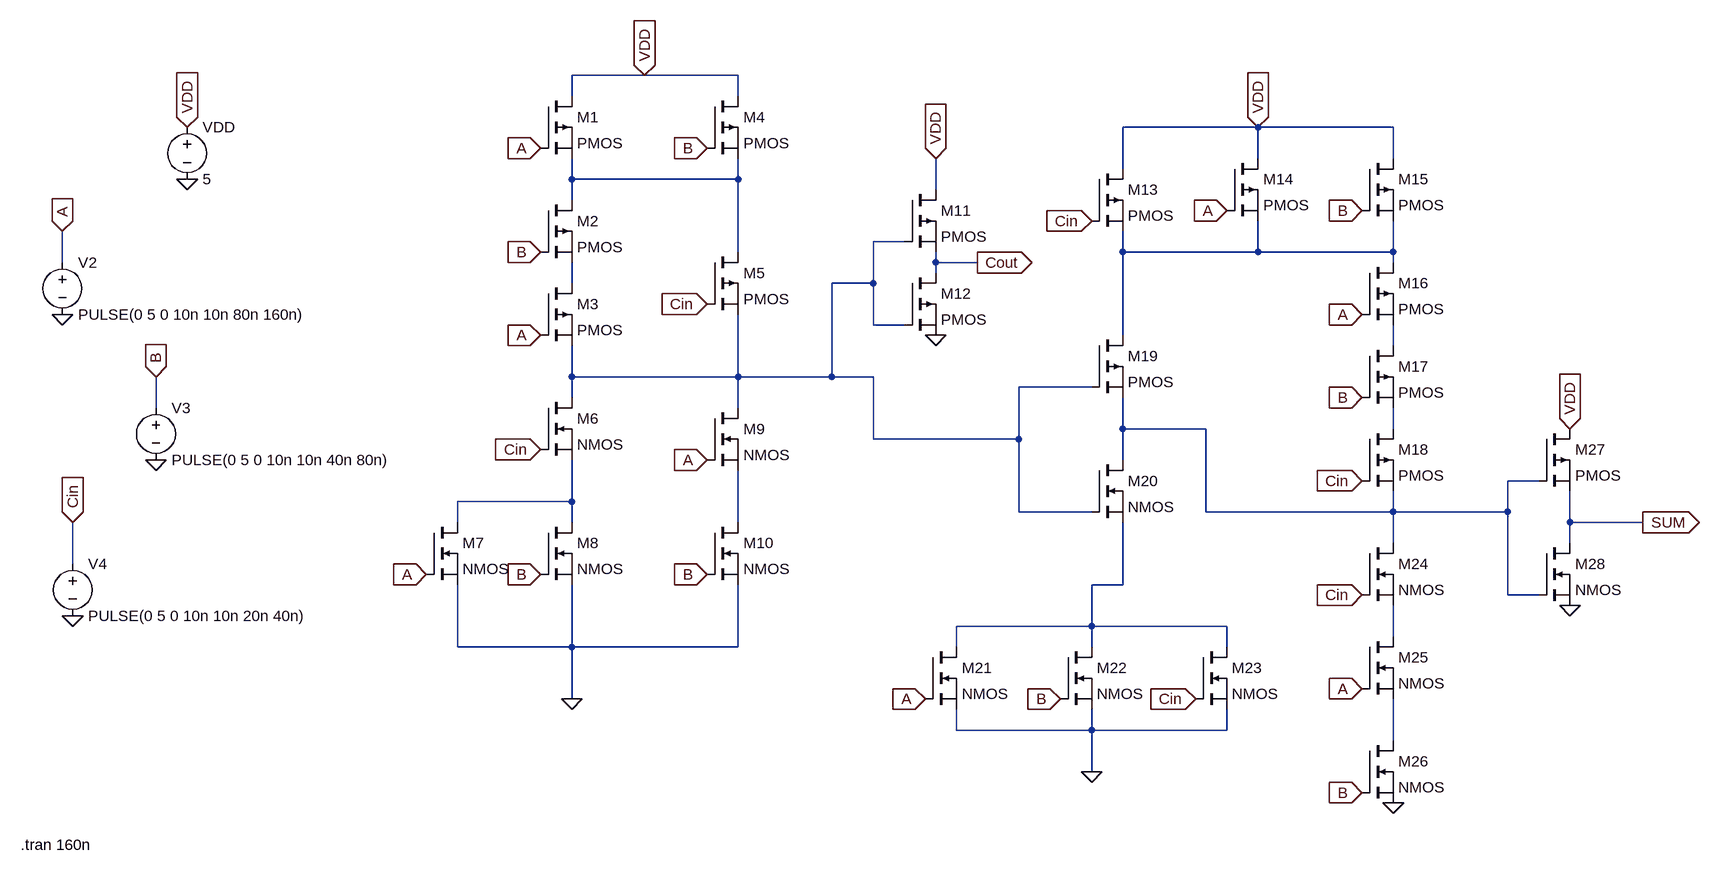
[diagram p0: schematic Draft1.asc]
Draft1.asc, the LTspice schematic file:
Version 4.1
SHEET 1 1920 1168
WIRE 272 -32 160 -32
WIRE 416 -32 272 -32
WIRE 160 0 160 -32
WIRE 416 0 416 -32
WIRE 1216 48 1008 48
WIRE 1424 48 1216 48
WIRE 1216 96 1216 48
WIRE 1424 96 1424 48
WIRE 1008 112 1008 48
WIRE 160 128 160 96
WIRE 416 128 416 96
WIRE 416 128 160 128
WIRE 720 144 720 96
WIRE 160 160 160 128
WIRE 672 224 624 224
WIRE 416 240 416 128
WIRE 1008 240 1008 208
WIRE 1216 240 1216 192
WIRE 1216 240 1008 240
WIRE 1424 240 1424 192
WIRE 1424 240 1216 240
WIRE -624 256 -624 208
WIRE 720 256 720 240
WIRE 784 256 720 256
WIRE 1424 256 1424 240
WIRE 720 272 720 256
WIRE 160 288 160 256
WIRE 624 288 624 224
WIRE 624 288 560 288
WIRE 624 352 624 288
WIRE 672 352 624 352
WIRE 1008 368 1008 240
WIRE 1424 384 1424 352
WIRE 160 432 160 384
WIRE 416 432 416 336
WIRE 416 432 160 432
WIRE 560 432 560 288
WIRE 560 432 416 432
WIRE 624 432 560 432
WIRE 960 448 848 448
WIRE 160 464 160 432
WIRE -480 480 -480 432
WIRE 416 480 416 432
WIRE 1008 512 1008 464
WIRE 1136 512 1008 512
WIRE 1424 512 1424 480
WIRE 624 528 624 432
WIRE 848 528 848 448
WIRE 848 528 624 528
WIRE 1008 560 1008 512
WIRE 1648 592 1600 592
WIRE 160 624 160 560
WIRE 160 624 -16 624
WIRE 848 640 848 528
WIRE 960 640 848 640
WIRE 1136 640 1136 512
WIRE 1424 640 1424 608
WIRE 1424 640 1136 640
WIRE 1600 640 1600 592
WIRE 1600 640 1424 640
WIRE -16 656 -16 624
WIRE 160 656 160 624
WIRE 416 656 416 576
WIRE 1696 656 1696 608
WIRE 1808 656 1696 656
WIRE 1424 688 1424 640
WIRE 1696 688 1696 656
WIRE -608 720 -608 656
WIRE 1008 752 1008 656
WIRE 1008 752 960 752
WIRE 1600 768 1600 640
WIRE 1648 768 1600 768
WIRE 960 816 960 752
WIRE 960 816 752 816
WIRE 1168 816 960 816
WIRE 1424 832 1424 784
WIRE -16 848 -16 752
WIRE 160 848 160 752
WIRE 160 848 -16 848
WIRE 416 848 416 752
WIRE 416 848 160 848
WIRE 752 848 752 816
WIRE 960 848 960 816
WIRE 1168 848 1168 816
WIRE 160 928 160 848
WIRE 752 976 752 944
WIRE 960 976 960 944
WIRE 960 976 752 976
WIRE 1168 976 1168 944
WIRE 1168 976 960 976
WIRE 1424 992 1424 928
WIRE 960 1040 960 976
FLAG 160 928 0
FLAG 720 368 0
FLAG 1424 1088 0
FLAG 1696 784 0
FLAG -432 128 0
FLAG -624 336 0
FLAG -480 560 0
FLAG -608 800 0
FLAG -624 208 A
IOPIN -624 208 In
FLAG 112 80 A
IOPIN 112 80 In
FLAG 112 368 A
IOPIN 112 368 In
FLAG -64 736 A
IOPIN -64 736 In
FLAG 368 560 A
IOPIN 368 560 In
FLAG 704 928 A
IOPIN 704 928 In
FLAG 1376 912 A
IOPIN 1376 912 In
FLAG 1376 336 A
IOPIN 1376 336 In
FLAG 1168 176 A
IOPIN 1168 176 In
FLAG -432 48 VDD
IOPIN -432 48 In
FLAG 272 -32 VDD
IOPIN 272 -32 In
FLAG 720 96 VDD
IOPIN 720 96 In
FLAG 1216 48 VDD
IOPIN 1216 48 In
FLAG 1696 512 VDD
IOPIN 1696 512 In
FLAG -480 432 B
IOPIN -480 432 In
FLAG 112 240 B
IOPIN 112 240 In
FLAG 112 736 B
IOPIN 112 736 In
FLAG 368 736 B
IOPIN 368 736 In
FLAG 912 928 B
IOPIN 912 928 In
FLAG 1376 176 B
IOPIN 1376 176 In
FLAG 1376 464 B
IOPIN 1376 464 In
FLAG 1376 1072 B
IOPIN 1376 1072 In
FLAG -608 656 Cin
IOPIN -608 656 In
FLAG 112 544 Cin
IOPIN 112 544 In
FLAG 368 320 Cin
IOPIN 368 320 In
FLAG 960 192 Cin
IOPIN 960 192 In
FLAG 1120 928 Cin
IOPIN 1120 928 In
FLAG 1376 592 Cin
IOPIN 1376 592 In
FLAG 1376 768 Cin
IOPIN 1376 768 In
FLAG 368 80 B
IOPIN 368 80 In
FLAG 960 1040 0
FLAG 784 256 Cout
IOPIN 784 256 Out
FLAG 1808 656 SUM
IOPIN 1808 656 Out
SYMBOL pmos 112 0 R0
SYMATTR InstName M1
SYMBOL pmos 112 160 R0
SYMATTR InstName M2
SYMBOL pmos 112 288 R0
SYMATTR InstName M3
SYMBOL pmos 368 0 R0
SYMATTR InstName M4
SYMBOL pmos 368 240 R0
SYMATTR InstName M5
SYMBOL nmos 112 464 R0
SYMATTR InstName M6
SYMBOL nmos -64 656 R0
SYMATTR InstName M7
SYMBOL nmos 112 656 R0
SYMATTR InstName M8
SYMBOL nmos 368 480 R0
SYMATTR InstName M9
SYMBOL nmos 368 656 R0
SYMATTR InstName M10
SYMBOL pmos 672 144 R0
SYMATTR InstName M11
SYMBOL pmos 672 272 R0
SYMATTR InstName M12
SYMBOL pmos 960 112 R0
SYMATTR InstName M13
SYMBOL pmos 1168 96 R0
SYMATTR InstName M14
SYMBOL pmos 1376 96 R0
SYMATTR InstName M15
SYMBOL pmos 1376 256 R0
SYMATTR InstName M16
SYMBOL pmos 1376 384 R0
SYMATTR InstName M17
SYMBOL pmos 1376 512 R0
SYMATTR InstName M18
SYMBOL pmos 960 368 R0
SYMATTR InstName M19
SYMBOL nmos 960 560 R0
SYMATTR InstName M20
SYMBOL nmos 704 848 R0
SYMATTR InstName M21
SYMBOL nmos 912 848 R0
SYMATTR InstName M22
SYMBOL nmos 1120 848 R0
SYMATTR InstName M23
SYMBOL nmos 1376 688 R0
SYMATTR InstName M24
SYMBOL nmos 1376 832 R0
SYMATTR InstName M25
SYMBOL nmos 1376 992 R0
SYMATTR InstName M26
SYMBOL pmos 1648 512 R0
SYMATTR InstName M27
SYMBOL nmos 1648 688 R0
SYMATTR InstName M28
SYMBOL voltage -432 32 R0
WINDOW 123 0 0 Left 0
WINDOW 39 0 0 Left 0
SYMATTR InstName VDD
SYMATTR Value 5
SYMBOL voltage -624 240 R0
WINDOW 123 0 0 Left 0
WINDOW 39 0 0 Left 0
SYMATTR InstName V2
SYMATTR Value PULSE(0 5 0 10n 10n 80n 160n)
SYMBOL voltage -480 464 R0
WINDOW 123 0 0 Left 0
WINDOW 39 0 0 Left 0
SYMATTR InstName V3
SYMATTR Value PULSE(0 5 0 10n 10n 40n 80n)
SYMBOL voltage -608 704 R0
WINDOW 123 0 0 Left 0
WINDOW 39 0 0 Left 0
SYMATTR InstName V4
SYMATTR Value PULSE(0 5 0 10n 10n 20n 40n)
TEXT -688 1152 Left 2 !.tran 160n

The netlist it stands for:
* Draft1.asc
M1 VDD A N001 N001 PMOS
M2 N001 B N004 N004 PMOS
M3 N004 A N002 N002 PMOS
M4 VDD B N001 N001 PMOS
M5 N001 Cin N002 N002 PMOS
M6 N002 Cin N008 N008 NMOS
M7 N008 A 0 0 NMOS
M8 N008 B 0 0 NMOS
M9 N002 A N009 N009 NMOS
M10 N009 B 0 0 NMOS
M11 VDD N002 Cout Cout PMOS
M12 Cout N002 0 0 PMOS
M13 VDD Cin N003 N003 PMOS
M14 VDD A N003 N003 PMOS
M15 VDD B N003 N003 PMOS
M16 N003 A N005 N005 PMOS
M17 N005 B N007 N007 PMOS
M18 N007 Cin N006 N006 PMOS
M19 N003 N002 N006 N006 PMOS
M20 N006 N002 N010 N010 NMOS
M21 N010 A 0 0 NMOS
M22 N010 B 0 0 NMOS
M23 N010 Cin 0 0 NMOS
M24 N006 Cin N011 N011 NMOS
M25 N011 A N012 N012 NMOS
M26 N012 B 0 0 NMOS
M27 VDD N006 SUM SUM PMOS
M28 SUM N006 0 0 NMOS
VDD VDD 0 5
V2 A 0 PULSE(0 5 0 10n 10n 80n 160n)
V3 B 0 PULSE(0 5 0 10n 10n 40n 80n)
V4 Cin 0 PULSE(0 5 0 10n 10n 20n 40n)
.model NMOS NMOS
.model PMOS PMOS
.lib standard.mos
.tran 160n
.backanno
.end